# EAGLE design tuerklingel (EAGLE 6.3)
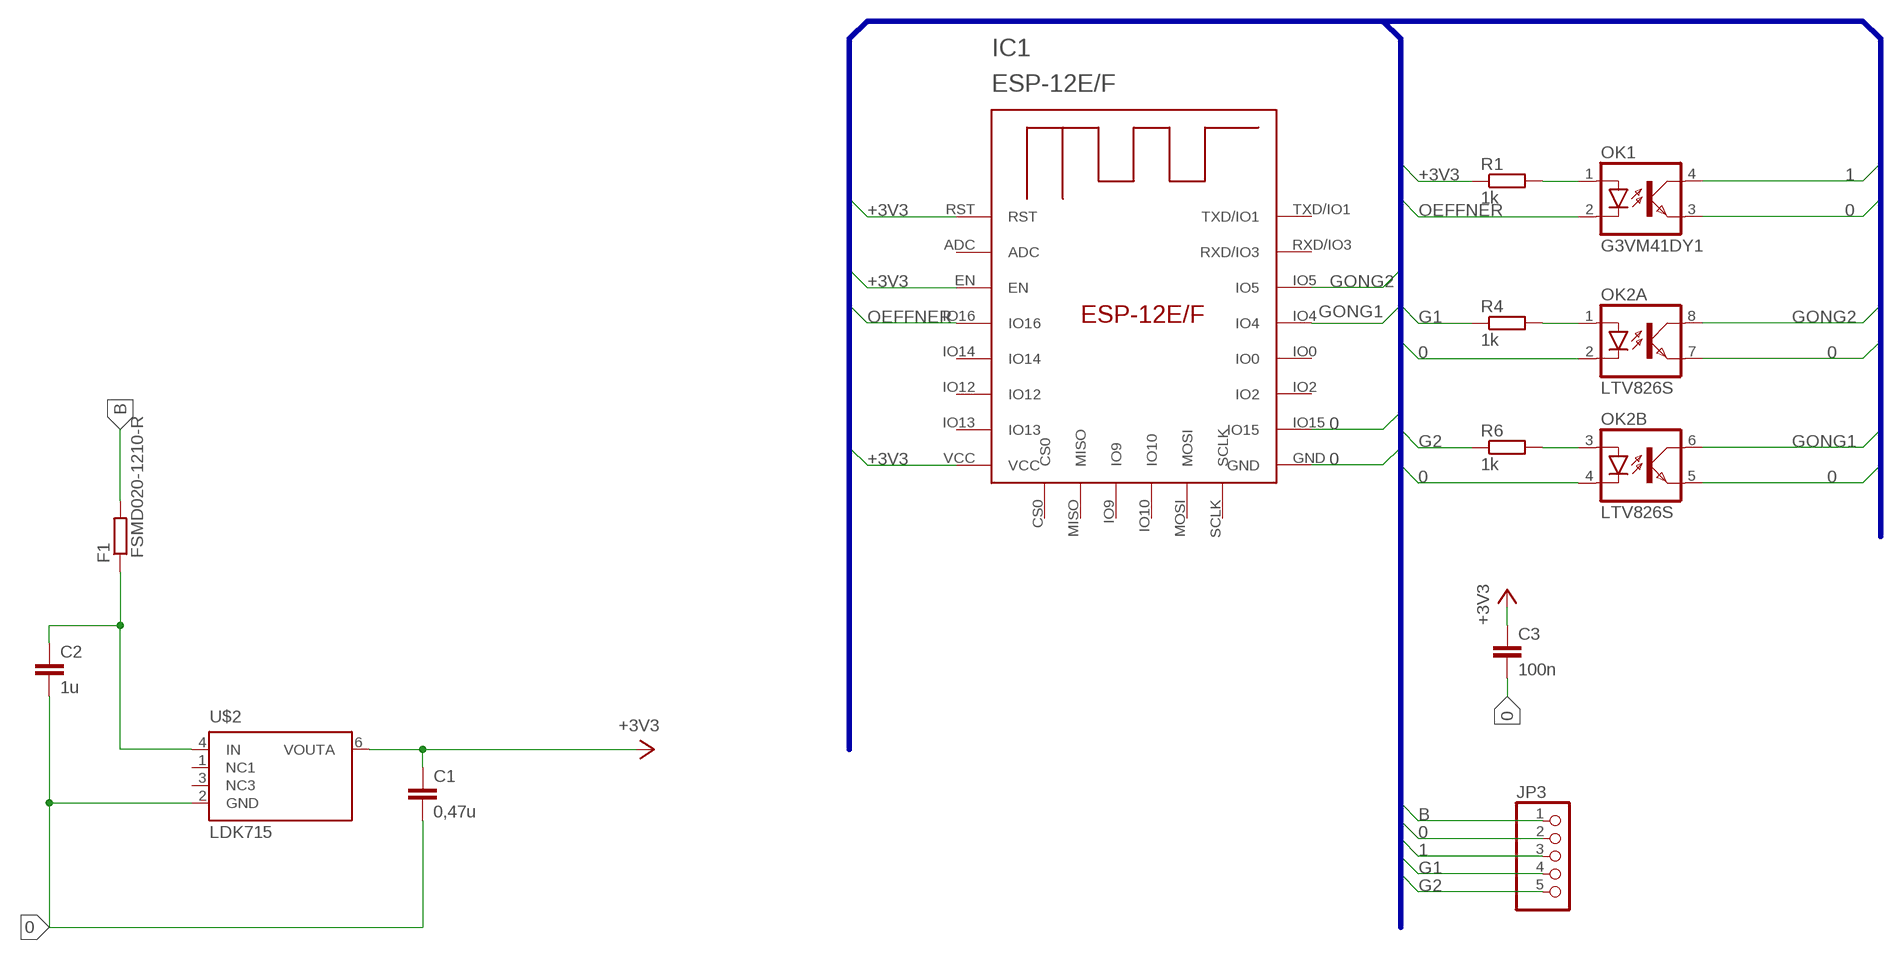
[diagram p0: schematic, sheet 1]

## Parts
C1  0,47u  C-EUC0805  [C0805]
C2  1u  C-EUC0805  [C0805]
C3  100n  C-EUC0805  [C0805]
F1  FSMD020-1210-R  R-EU_R1210  [R1210]
IC1  ESP-12E/F  [ESP-12E]
JP3  PINHD-1X5  [1X05]
OK1  G3VM41DY1  LTV816S  [DIL4-SMD]
OK2  LTV826S  [DIL8-SMD]
R1  1k  R-EU_R0805  [R0805]
R4  1k  R-EU_R0805  [R0805]
R6  1k  R-EU_R0805  [R0805]
U$2  LDK715  [SOT23-6]

## Nets
0: C1.2 C2.2 C3.2 IC1.GND IC1.IO15 JP3.2 OK1.3(EMIT) OK2.2(A:C) OK2.4(B:C) OK2.5(B:EMIT) OK2.7(A:EMIT) U$2.2(GND)
1: JP3.3 OK1.4(COL)
+3V3: C1.1 C3.1 IC1.EN IC1.RST IC1.VCC R1.1 U$2.6(VOUTA)
B: F1.2 JP3.1
G1: JP3.4 R4.1
G2: JP3.5 R6.1
GONG1: IC1.IO4 OK2.6(B:COL)
GONG2: IC1.IO5 OK2.8(A:COL)
N$1: C2.1 F1.1 U$2.4(IN)
N$3: OK1.1(A) R1.2
N$6: OK2.1(A:A) R4.2
N$7: OK2.3(B:A) R6.2
OEFFNER: IC1.IO16 OK1.2(C)
Unconnected: IC1.ADC IC1.CS0 IC1.IO0 IC1.IO2 IC1.IO9 IC1.IO10 IC1.IO12 IC1.IO13 IC1.IO14 IC1.MISO IC1.MOSI IC1.RXD/IO3 IC1.SCLK IC1.TXD/IO1 U$2.1(NC1) U$2.3(NC3)

## Buses
0,1,+3V3,B,G1,G2,GONG1,GONG2,OEFFNER,VDD

## Library data of the parts
C1-C3 = rcl:C-EU: CAPACITOR, European symbol
F1 = resistor:R-EU_: RESISTOR, European symbol
IC1 = esp-12e-f:ESP-12E/F
JP3 = pinhead:PINHD-1X5: PIN HEADER
OK1 = optocoupler:LTV816: OPTO COUPLER Source: LITEON, LTV816.pdf
OK2 = optocoupler:LTV826: OPTO COUPLER Source: LITEON, LTV816.pdf; OC_FARNELL: unknown; OC_NEWARK: unknown
R1 R4 R6 = rcl:R-EU_: RESISTOR, European symbol
U$2 = ARM:LDK715

## Board
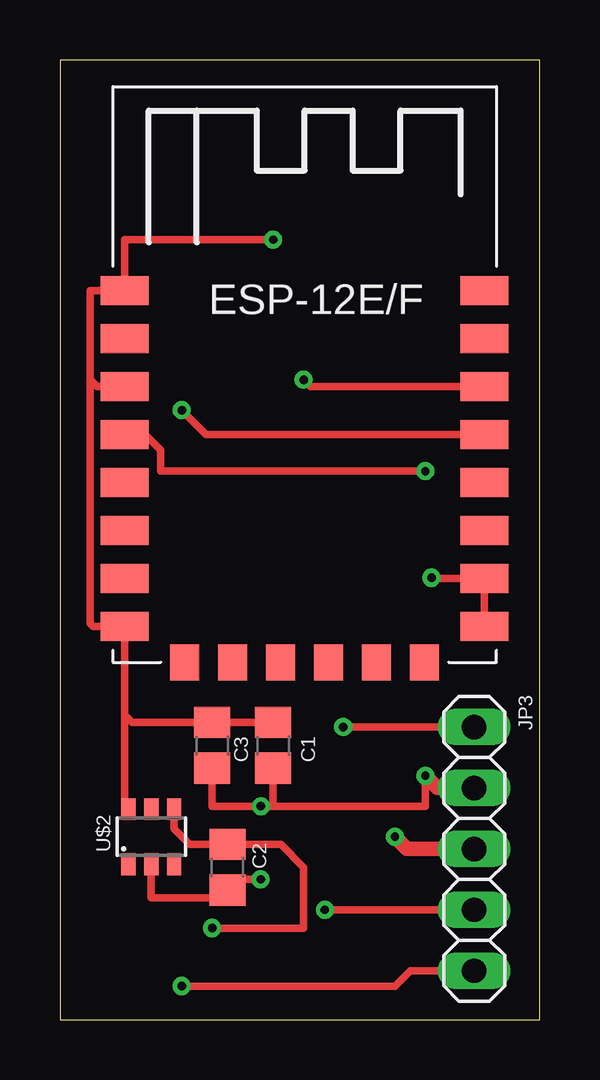
[diagram p1: board, top side]
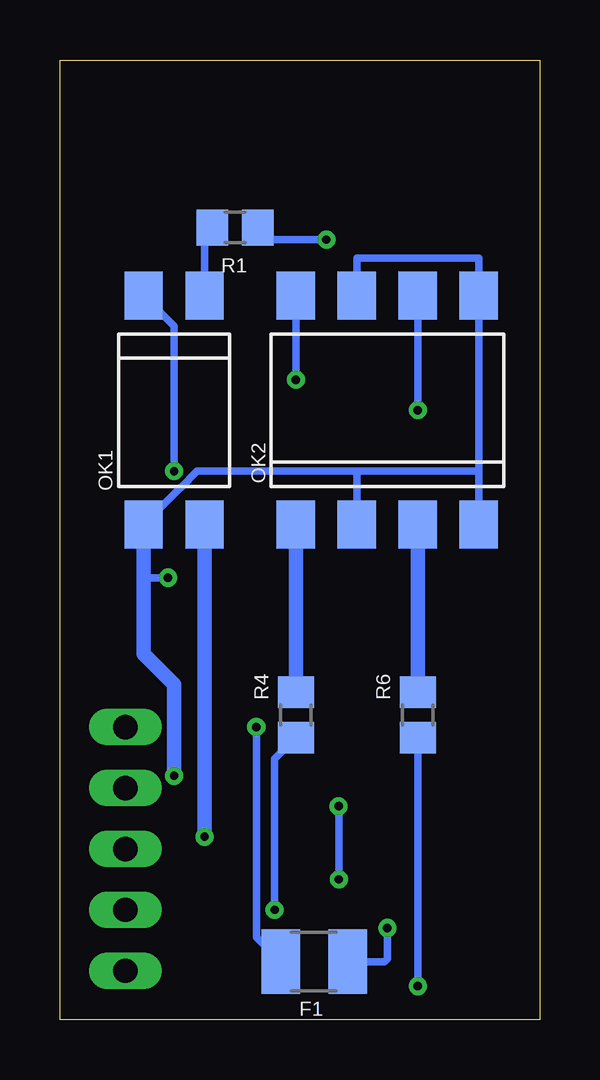
[diagram p2: board, bottom side, seen from below]

Size 20 x 40 mm. Coordinates in mm from the lower left corner, seen from the top.
Outline: 0,0 20,0 20,40 0,40 0,0
Copper layers (1*16): Top 0.035mm / dielectric 1.5mm / Bottom 0.035mm
Design rules "default": minimum track width 6mil, minimum drill 0.35mm, track to track 6mil, track to pad 6mil, pad to pad 6mil, via to via 6mil, smd to smd 6mil, copper to edge 40mil, drill to drill 6mil, minimum pad ring 10mil, minimum via ring 8mil, stop-mask expansion 4mil, vias tented up to drill 0mil, thermal gap 10mil

### Footprints (pad centres in the part's own frame; a part is rotated, then mirrored left to right if it is on the bottom)
C0805 = smd 1.3 x 1.5: 1 -0.95,0; 2 0.95,0
R1210 = smd 1.6 x 2.7: 1 -1.4,0; 2 1.4,0
ESP-12E = smd 2 x 1.2: ADC -7.46,5.53; EN -7.46,3.53; GND 7.54,-6.47; IO0 7.54,-0.47; IO2 7.54,-2.47; IO4 7.54,1.53; IO5 7.54,3.53; IO12 -7.46,-2.47; IO13 -7.46,-4.47; IO14 -7.46,-0.47; IO15 7.54,-4.47; IO16 -7.46,1.53; RST -7.46,7.53; RXD/IO3 7.54,5.53; TXD/IO1 7.54,7.53; VCC -7.46,-6.47 | smd 1.2 x 1.5: CS0 -4.96,-7.97; IO9 -0.96,-7.97; IO10 1.04,-7.97; MISO -2.96,-7.97; MOSI 3.04,-7.97; SCLK 5.04,-7.97
1X05 = drill 1.016 long: 1 -5.08,0; 2 -2.54,0; 3 0,0; 4 2.54,0; 5 5.08,0
DIL4-SMD = smd 1.6 x 2: 1 -1.27,-4.77; 2 1.27,-4.77; 3 1.27,4.77; 4 -1.27,4.77
DIL8-SMD = smd 1.6 x 2: 1 -3.81,-4.77; 2 -1.27,-4.77; 3 1.27,-4.77; 4 3.81,-4.77; 5 3.81,4.77; 6 1.27,4.77; 7 -1.27,4.77; 8 -3.81,4.77
R0805 = smd 1.3 x 1.5: 1 -0.95,0; 2 0.95,0
SOT23-6 = smd 0.6 x 0.9: 1 -0.95,-1.15; 2 0,-1.15; 3 0.95,-1.15; 4 0.95,1.15; 5 0,1.15; 6 -0.95,1.15

### Placement (x,y rotation side)
C1  8.89,11.43 270 top
C2  6.99,6.35 270 top
C3  6.35,11.43 270 top
F1  9.4,2.41 180 bottom
IC1  10.16,22.86 0 top
JP3  17.27,7.11 270 top
OK1  15.24,25.4 180 bottom
OK2  6.35,25.4 0 bottom
R1  12.7,33.02 180 bottom
R4  10.16,12.7 90 bottom
R6  5.08,12.7 90 bottom
U$2  3.81,7.62 0 top

### Tracks (layer width: path | path; a pad name or v marks a point on that pad's centre or on a via)
0  (via drill 0.35)
  Top 0.305: U$2.2 3.81,5.08 6.67,5.08 C2.2 7.43,5.84 v8.37,5.84 | IC1.GND IC1.IO15 15.52,18.39 v15.49,18.41 | C3.2 6.35,8.89 v8.38,8.89 8.89,8.89 | 8.89,8.89 15.24,8.89 v15.24,10.16 | C1.2 8.89,8.89
  Top 0.61: v15.24,10.16 15.75,9.65 JP3.2
  Bottom 0.305: OK2.2 7.62,22.86 | 7.62,22.86 2.54,22.86 | 2.54,22.86 OK2.4 | OK1.3 14.96,22.18 14.27,22.86 7.62,22.86 | OK2.7 7.62,31.75 2.54,31.75 OK2.5 2.54,22.86 | v8.37,5.84 v8.37,8.89 v8.38,8.89 | v15.49,18.41 16.51,18.41 16.51,19.05
  Bottom 0.61: OK1.3 16.51,19.05 16.51,15.24 15.24,13.97 v15.24,10.16
1  (via drill 0.35)
  Top 0.61: v13.97,7.62 14.48,7.11 JP3.3
  Bottom 0.61: OK1.4 v13.97,7.62
+3V3  (via drill 0.35)
  Top 0.305: v8.89,32.51 2.7,32.51 IC1.RST 1.27,30.39 1.27,26.67 | IC1.EN 1.55,26.39 1.27,26.67 | C1.1 C3.1 3.02,12.38 2.7,12.7 | 2.7,12.7 IC1.VCC 1.39,16.39 1.27,16.51 1.27,26.67 | U$2.6 2.7,8.93 2.7,12.7
  Bottom 0.305: R1.1 11.75,32.51 v8.89,32.51
B  (via drill 0.35)
  Top 0.305: v11.81,12.19 JP3.1
  Bottom 0.305: F1.2 11.81,3.43 v11.81,12.19
G1  (via drill 0.35)
  Top 0.305: JP3.4 v11.05,4.57
  Bottom 0.305: R4.1 11.05,10.86 v11.05,4.57
G2  (via drill 0.35)
  Top 0.305: v5.08,1.39 13.97,1.39 14.61,2.03 JP3.5
  Bottom 0.305: R6.1 v5.08,1.39
GONG1  (via drill 0.35)
  Top 0.305: v5.08,25.4 6.09,24.39 IC1.IO4
  Bottom 0.305: OK2.6 v5.08,25.4
GONG2  (via drill 0.35)
  Top 0.305: IC1.IO5 10.44,26.39 v10.16,26.67
  Bottom 0.305: OK2.8 v10.16,26.67
N$1  (via drill 0.35)
  Top 0.305: v6.35,3.81 7.62,3.81 8.06,3.81 10.16,3.81 10.16,6.35 9.21,7.3 C2.1 5.4,7.3 4.76,7.94 U$2.4
  Bottom 0.305: v6.35,3.81 6.35,2.54 6.48,2.41 F1.1
N$3
  Bottom 0.305: R1.2 13.97,32.7 OK1.1
N$6
  Bottom 0.61: R4.2 OK2.1
N$7
  Bottom 0.61: OK2.3 R6.2
OEFFNER  (via drill 0.35)
  Top 0.305: IC1.IO16 3.55,24.39 4.19,23.75 4.19,22.86 v15.24,22.86
  Bottom 0.305: OK1.2 15.24,28.9 v15.24,22.86